# EasyEDA Pro project adapter_rfm95w_nrf242.eprj, schematic Schematic1
Board Name: Schematic1; Create Date: 2026-07-05; Page Name: P1; Project Name: adapter_rfm95w_nrf242; Schematic Name: Schematic1; Update Date: 2026-07-05; Company: EasyEDA.com; Page Size: A4; Version: V1.0
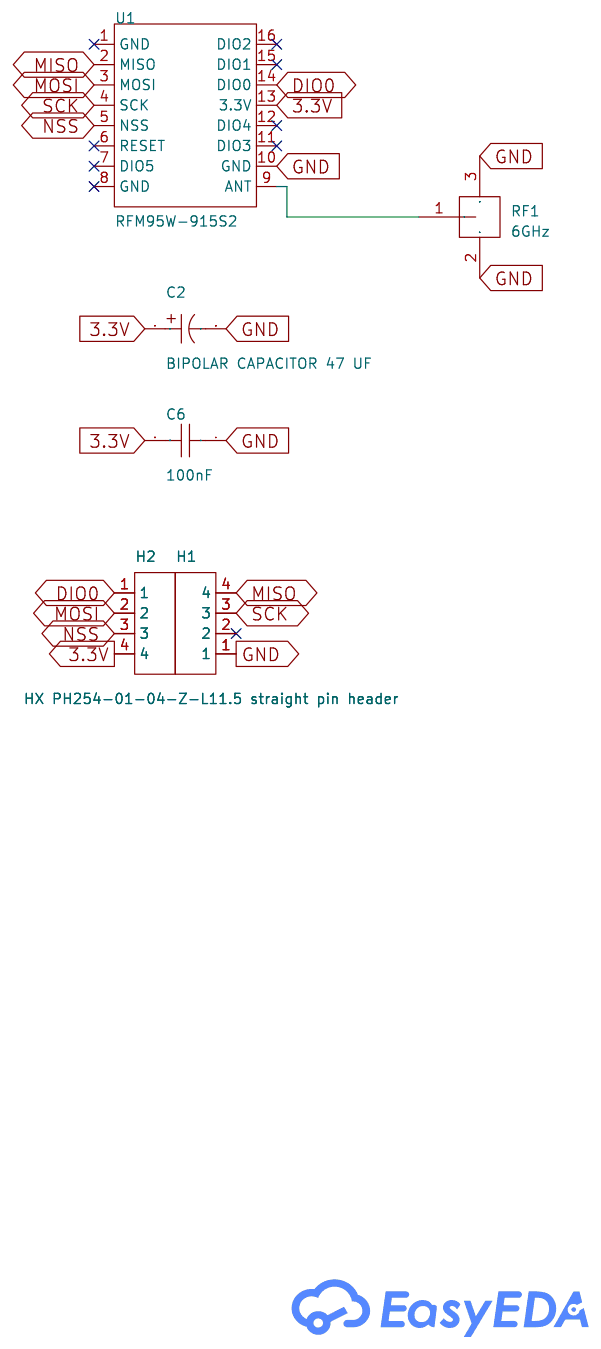
[diagram p0: schematic sheet]

## Parts
C2  BIPOLAR CAPACITOR 47 UF  [CAP-TH_BD10.0-P5.00-D0.6-FD]
C6  100nF  [C0603]
H1  HX PH254-01-04-Z-L11.5 straight pin header  [HDR-TH_4P-HX-PH254-01-04-Z-L11.5]
H2  HX PH254-01-04-Z-L11.5 straight pin header  [HDR-TH_4P-HX-PH254-01-04-Z-L11.5]
RF1  6GHz  [IPEX-SMD_3P-L2.6-W2.6-LS3.0_MHFIANTENNACONNECTOR]
U1  RFM95W-915S2  [WIRELM-SMD_16P-L16.0-W16.0-P2.00_LORA-CC68-915MHZ-TCXO]

## Library data of the parts
C2 = BIPOLAR CAPACITOR 22,0 UF: Supplier Part: C6131732; Manufacturer: Visaton; Supplier Footprint: 插件,D10xL25.5mm; JLCPCB Part Class: Extended Part; Supplier: LCSC
C6 = CAP_0603: Supplier Footprint: 0603
H1 H2 = HX PH254-01-04-Z-L11.5 straight pin header: LCSC Part Name: 1x4P 间距:2.54mm 方针 直插; Supplier Part: C52016392; Manufacturer: hanxia(韩下); Supplier Footprint: 插件,P=2.54mm; JLCPCB Part Class: Extended Part; Datasheet: https://item.szlcsc.com/datasheet/HX%2520PH254-01-04-Z-L11.5%2520straight%2520pin%2520header/54760437.html; Supplier: LCSC; Pin Structure: 1x4P; Pitch: 2.54mm; Circluar Pins/Square Pins: Pin Header; Mounting Type: Through Hole; Number of Rows: 1; Number of Pins: 4P; Current Rating: 3A; Voltage Rating (Max): 1kV; Length of Mating Pin: 6mm; Insulation Height: 2.5mm; Length of End Connection Pin: 3mm; Contact Material: Brass; Contact Plating: Gold; Operating Temperature: -40℃~+105℃
RF1 = HL2-IPEX1-SMT: LCSC Part Name: 内针 IPEX; Supplier Part: C22468771; Manufacturer: HenryTech(恒利泰); Supplier Footprint: SMD; JLCPCB Part Class: Extended Part; Datasheet: https://item.szlcsc.com/datasheet/HL2-IPEX1-SMT/24177464.html; Supplier: LCSC; Connector Type: Board Side; Interface: Male Pin; Number of Ports: 1; Interface Diameter: 2mm; RF Series: IPEX; Operating Temperature Range: -40℃~+90℃
U1 = RFM95W-915S2: Supplier Part: C6760738; Manufacturer: RF Solutions; Supplier Footprint: SMD-16P; Datasheet: https://atta.szlcsc.com/upload/public/pdf/source/231023/1463993415RFM95_96_97_98W.pdf-28e762a2720fe67dd47c50deba0a11b7.pdf; Supplier: LCSC; Output Power: 20dBm; Interface Type: SPI; Modulation System: MSK；LoRa；OOK；GFSK；FSK；GMSK; Voltage - Supply: 1.8V~3.7V; Receive  Current: 10.3mA; Sensitivity: -148dBm

## Nets
3.3V: C2.1 C6.2 H2.4 U1.13(3.3V)
GND: C2.2 C6.1 H1.1 RF1.2 RF1.3 U1.10(GND)
DIO0: H2.1 U1.14(DIO0)
MISO: H1.4 U1.2(MISO)
MOSI: H2.2 U1.3(MOSI)
NSS: H2.3 U1.5(NSS)
SCK: H1.3 U1.4(SCK)
$1N1589: RF1.1 U1.9(ANT)

Not connected (* = marked no-connect by the designer): H1 2*; U1 1(GND)* 6(RESET)* 7(DIO5)* 8(GND)* 11(DIO3)* 12(DIO4)* 15(DIO1)* 16(DIO2)*
